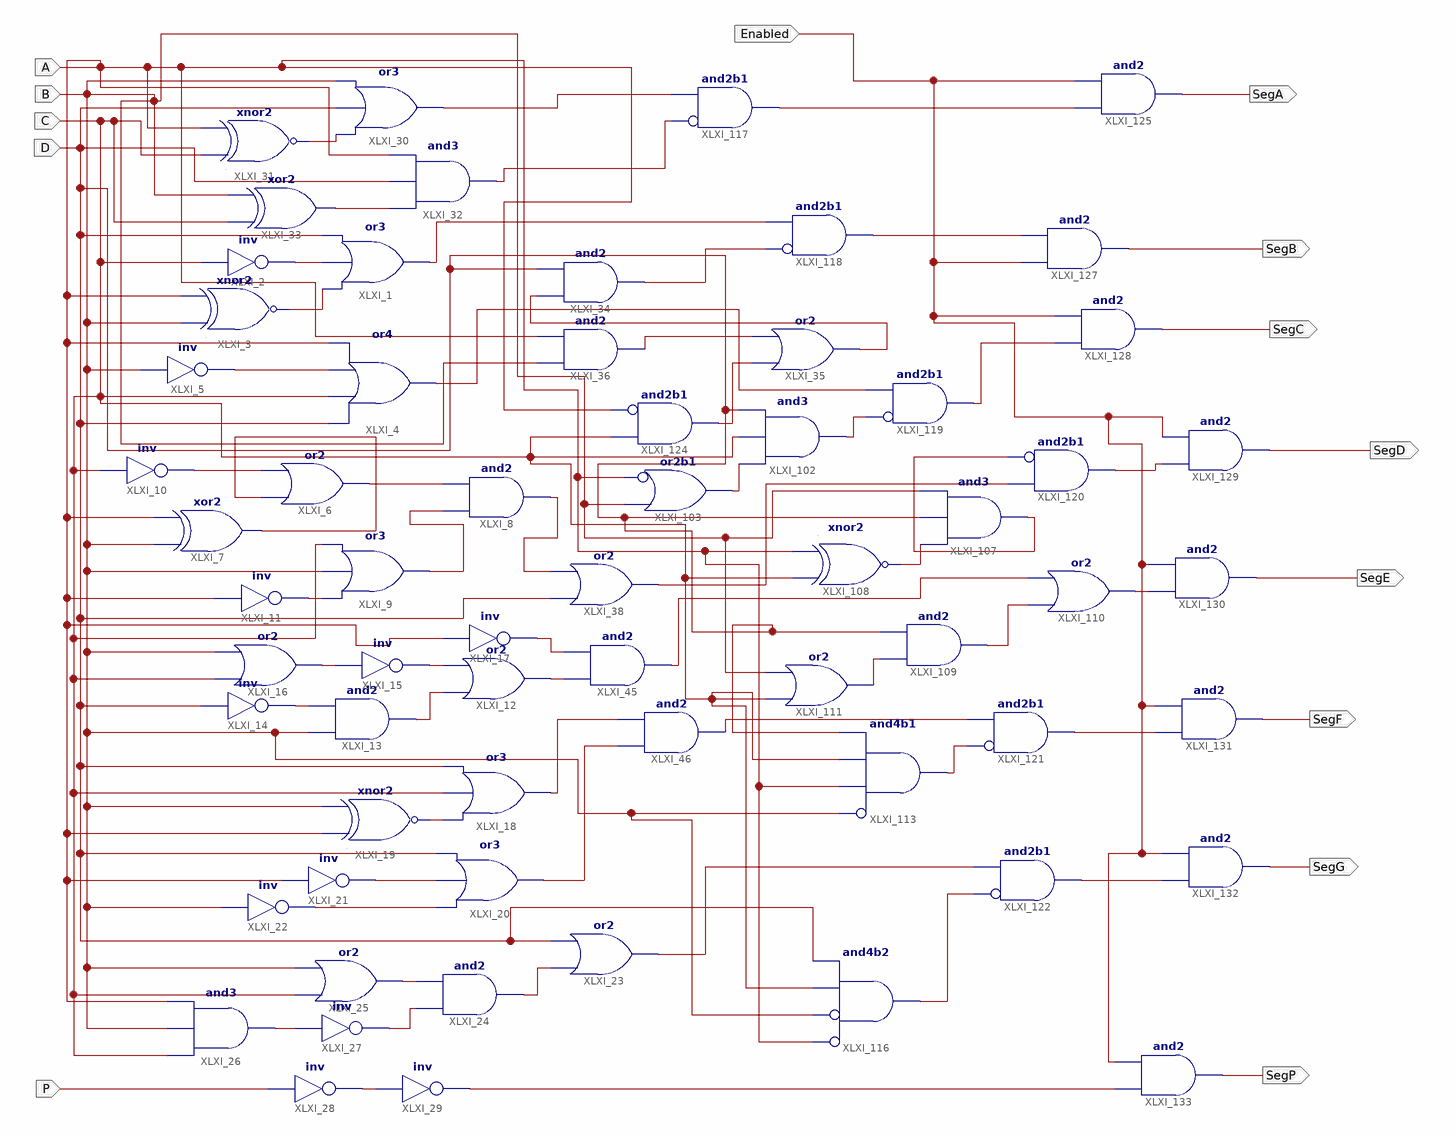
[diagram p0: schematic sheet 1]
// Xilinx ISE schematic SvnEnable.sch (spartan6) as structural Verilog: 63 symbols, 14 ports
module SvnEnable (
  input  D,
  input  P,
  input  A,
  input  C,
  input  B,
  input  Enabled,
  output SegA,
  output SegB,
  output SegC,
  output SegD,
  output SegE,
  output SegF,
  output SegG,
  output SegP
);

  wire m, n, o, s, x, XLXN_1, XLXN_2, XLXN_3, XLXN_4, XLXN_5, XLXN_6, XLXN_7, XLXN_8, XLXN_9, XLXN_10,
       XLXN_12, XLXN_18, XLXN_20, XLXN_21, XLXN_22, XLXN_24, XLXN_25, XLXN_46, XLXN_48, XLXN_58, XLXN_107,
       XLXN_110, XLXN_112, XLXN_113, XLXN_114, XLXN_116, XLXN_120, XLXN_122, XLXN_136, XLXN_139, XLXN_146,
       XLXN_147, XLXN_211, XLXN_214, XLXN_215, XLXN_219, XLXN_222, XLXN_223, XLXN_236, XLXN_240, XLXN_246,
       XLXN_253, XLXN_258, XLXN_260, XLXN_265, XLXN_267, XLXN_278, XLXN_286, XLXN_290, XLXN_348;

  or XLXI_1 (m, XLXN_3, XLXN_2, D);
  not XLXI_2 (XLXN_2, C);
  xnor XLXI_3 (XLXN_3, B, A);
  or XLXI_4 (o, D, C, XLXN_4, A);
  not XLXI_5 (XLXN_4, B);
  or XLXI_6 (XLXN_5, XLXN_7, XLXN_6);
  xor XLXI_7 (XLXN_7, B, A);
  and XLXI_8 (XLXN_46, XLXN_8, XLXN_5);
  or XLXI_9 (XLXN_8, XLXN_9, B, C);
  not XLXI_10 (XLXN_6, C);
  not XLXI_11 (XLXN_9, A);
  or XLXI_12 (XLXN_10, XLXN_278, XLXN_18);
  and XLXI_13 (XLXN_278, B, XLXN_12);
  not XLXI_14 (XLXN_12, D);
  not XLXI_15 (XLXN_18, XLXN_286);
  or XLXI_16 (XLXN_286, C, B);
  not XLXI_17 (XLXN_20, A);
  or XLXI_18 (XLXN_58, XLXN_21, C, D);
  xnor XLXI_19 (XLXN_21, A, B);
  or XLXI_20 (XLXN_22, XLXN_24, XLXN_290, D);
  not XLXI_21 (XLXN_290, A);
  not XLXI_22 (XLXN_24, B);
  or XLXI_23 (XLXN_110, XLXN_25, D);
  and XLXI_24 (XLXN_25, XLXN_114, XLXN_112);
  or XLXI_25 (XLXN_112, C, B);
  and XLXI_26 (XLXN_113, C, B, A);
  not XLXI_27 (XLXN_114, XLXN_113);
  not XLXI_28 (XLXN_116, P);
  not XLXI_29 (XLXN_267, XLXN_116);
  or XLXI_30 (XLXN_122, XLXN_1, D, B);
  xnor XLXI_31 (XLXN_1, C, A);
  and XLXI_32 (n, XLXN_120, D, A);
  xor XLXI_33 (XLXN_120, C, B);
  and XLXI_34 (XLXN_147, XLXN_136, D);
  or XLXI_35 (XLXN_136, XLXN_146, XLXN_139);
  and XLXI_36 (XLXN_139, B, A);
  and XLXI_102 (XLXN_211, XLXN_214, C, D);
  or XLXI_38 (XLXN_48, D, XLXN_46);
  or XLXI_103 (XLXN_214, ~A, B);  // or2b1
  and XLXI_107 (XLXN_215, B, D, XLXN_219);
  xnor XLXI_108 (XLXN_219, A, C);
  or XLXI_110 (XLXN_258, s, XLXN_222);
  and XLXI_109 (XLXN_222, D, XLXN_223);
  or XLXI_111 (XLXN_223, B, C);
  and XLXI_45 (s, XLXN_10, XLXN_20);
  and XLXI_46 (XLXN_107, XLXN_22, XLXN_58);
  and XLXI_113 (XLXN_236, ~B, A, C, D);  // and4b1
  and XLXI_116 (XLXN_240, ~A, ~B, C, D);  // and4b2
  and XLXI_117 (x, ~n, XLXN_122);  // and2b1
  and XLXI_118 (XLXN_246, ~XLXN_147, m);  // and2b1
  and XLXI_119 (XLXN_348, ~XLXN_211, o);  // and2b1
  and XLXI_121 (XLXN_260, ~XLXN_236, XLXN_107);  // and2b1
  and XLXI_122 (XLXN_265, ~XLXN_240, XLXN_110);  // and2b1
  and XLXI_124 (XLXN_146, ~A, C);  // and2b1
  and XLXI_125 (SegA, x, Enabled);
  and XLXI_127 (SegB, Enabled, XLXN_246);
  and XLXI_128 (SegC, XLXN_348, Enabled);
  and XLXI_129 (SegD, XLXN_253, Enabled);
  and XLXI_120 (XLXN_253, ~XLXN_215, XLXN_48);  // and2b1
  and XLXI_130 (SegE, XLXN_258, Enabled);
  and XLXI_131 (SegF, XLXN_260, Enabled);
  and XLXI_132 (SegG, XLXN_265, Enabled);
  and XLXI_133 (SegP, XLXN_267, Enabled);
endmodule
